# EAGLE design anglesenseor (EAGLE 9.2.2)
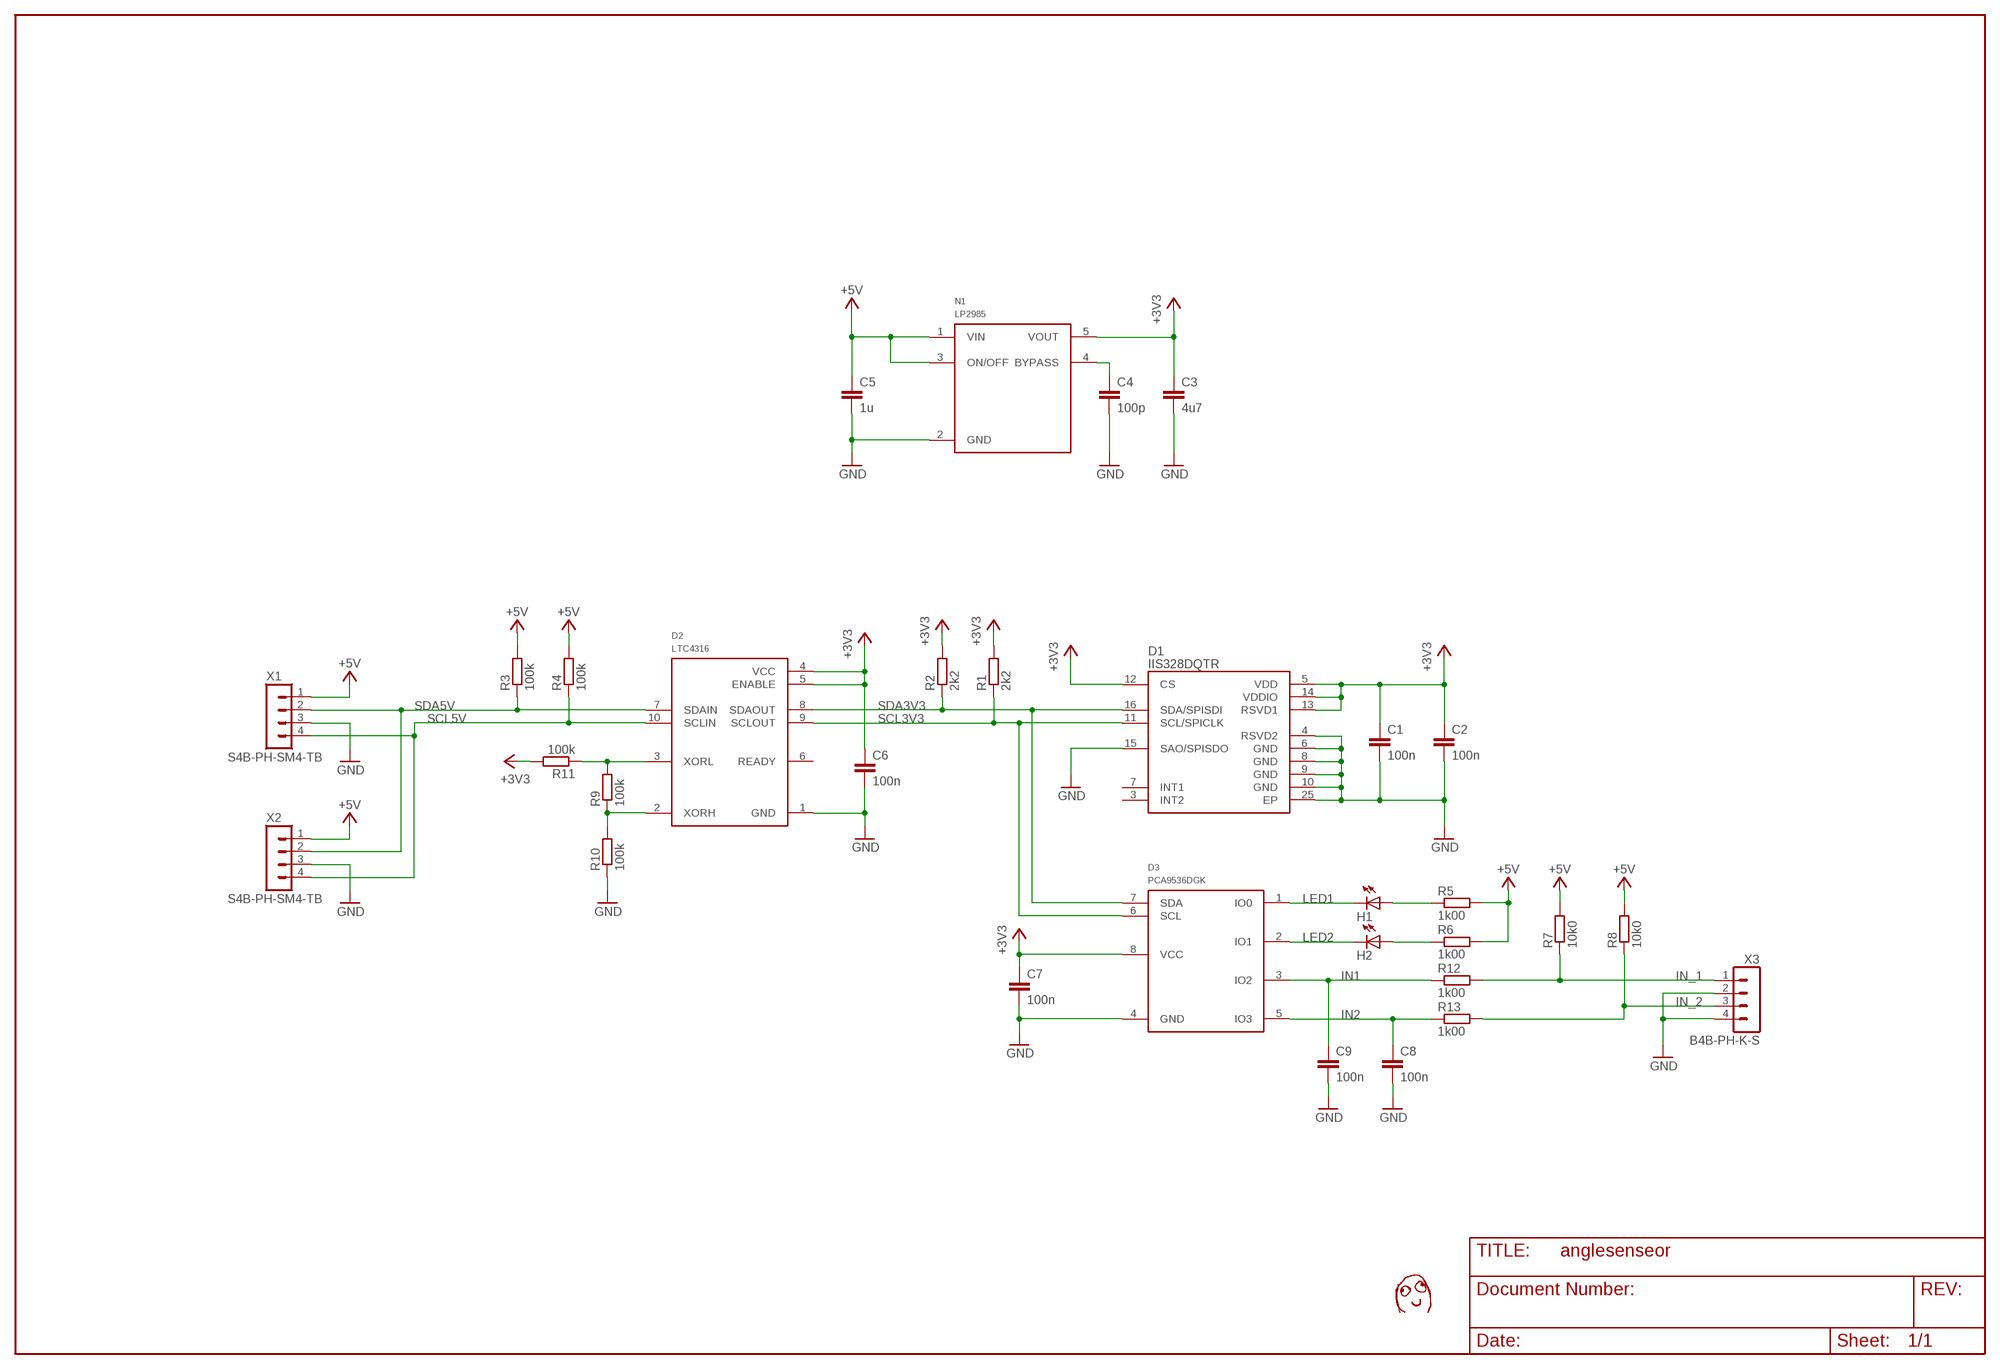
[diagram p0: schematic, sheet 1]

## Parts
C1  100n  CAP0603  [C0603]
C2  100n  CAP0603  [C0603]
C3  4u7  CAP0805  [OMAT_IC_2_C0805]
C4  100p  CAP0603  [OMAT_IC_2_C0603]
C5  1u  CAP0603  [OMAT_IC_2_C0603]
C6  100n  CAP0603  [C0603]
C7  100n  CAP0603  [C0603]
C8  100n  CAP0603  [C0603]
C9  100n  CAP0603  [C0603]
D1  IIS328DQTR  [QFN50P400X400X100-25N]
D2  LTC4316  [MSOP-10]
D3  PCA9536DGK  [TSSOP8-66]
H1  LEDCHIPLED_0603  [CHIPLED_0603]
H2  LEDCHIPLED_0603  [CHIPLED_0603]
N1  LP2985  [SOT95P280X145-5N]
R1  2k2  RES0603  [R0603]
R2  2k2  RES0603  [R0603]
R3  100k  RES0603  [R0603]
R4  100k  RES0603  [R0603]
R5  1k00  RES0603  [R0603]
R6  1k00  RES0603  [R0603]
R7  10k0  RES0603  [R0603]
R8  10k0  RES0603  [R0603]
R9  100k  RES0603  [R0603]
R10  100k  RES0603  [R0603]
R11  100k  RES0603  [R0603]
R12  1k00  RES0603  [R0603]
R13  1k00  RES0603  [R0603]
U$1  DAFUG  [DAFUG]
X1  S4B-PH-SM4-TB  [JST-PH2.0-RA-4]
X2  S4B-PH-SM4-TB  [JST-PH2.0-RA-4]
X3  B4B-PH-K-S  [B4B-PH-K-S]

## Nets
+3V3: C1.1 C2.1 C3.1 C6.1 C7.1 D1.5(VDD) D1.12(CS) D1.13(RSVD1) D1.14(VDDIO) D2.4(VCC) D2.5(ENABLE) D3.8(VCC) N1.5(VOUT) R1.2 R2.2 R11.2
+5V: C5.1 N1.1(VIN) N1.3(ON/OFF) R3.2 R4.2 R5.2 R6.2 R7.2 R8.2 X1.1 X2.1
GND: C1.2 C2.2 C3.2 C4.2 C5.2 C6.2 C7.2 C8.2 C9.2 D1.4(RSVD2) D1.6(GND) D1.8(GND) D1.9(GND) D1.10(GND) D1.15(SAO/SPISDO) D1.25(EP) D2.1(GND) D3.4(GND) N1.2(GND) R10.1 X1.3 X2.3 X3.2 X3.4
IN1: C9.1 D3.3(IO2) R12.1
IN2: C8.1 D3.5(IO3) R13.1
IN_1: R7.1 R12.2 X3.1
IN_2: R8.1 R13.2 X3.3
LED1: D3.1(IO0) H1.C
LED2: D3.2(IO1) H2.C
N$1: C4.1 N1.4(BYPASS)
N$4: D2.3(XORL) R9.2 R11.1
N$7: D2.2(XORH) R9.1 R10.2
N$8: H2.A R6.1
N$9: H1.A R5.1
SCL3V3: D1.11(SCL/SPICLK) D2.9(SCLOUT) D3.6(SCL) R1.1
SCL5V: D2.10(SCLIN) R4.1 X1.4 X2.4
SDA3V3: D1.16(SDA/SPISDI) D2.8(SDAOUT) D3.7(SDA) R2.1
SDA5V: D2.7(SDAIN) R3.1 X1.2 X2.2
Unconnected: D1.3(INT2) D1.7(INT1) D2.6(READY)

## Library data of the parts
C1 C2 C6-C9 = passiivit:CAP
C3-C5 = cpu:CAP
D1 = piirit:IIS328DQTR
D2 = piirit:LTC4316
D3 = piirit:PCA9536
H1 H2 = diskreetit:LED: LED OSRAM: - CHIPLED LG R971, LG N971, LY N971, LG Q971, LY Q971, LO R971, LY R971 LH N974, LH R974 LS Q976, LO Q976, LY Q976 LO Q996 - Hyper CHIPLED LW Q18S LB Q993, LB Q99A, LB R99A - SideLED LS A670, LO A670, LY A670, LG A670, LP A670 LB A673, LV A673, LT A673, LW A673 LH A674 LY A675 LS A676, LA A676, LO A676, LY A676, LW A676 LS A679, LY A679, LG A679 - Hyper Micro SIDELED® LS Y876, LA Y876, LO Y876, LY Y876 LT Y87S - SmartLED LW L88C, LW L88S LB L89C, LB L89S, LG L890 LS L89K, LO L89K, LY L89K LS L896, LA L896, LO L896, LY L896 - TOPLED LS T670, LO T670, LY T670, LG T670, LP T670 LSG T670, LSP T670, LSY T670, LOP T670, LYG T670 LG T671, LOG T671, LSG T671 LB T673, LV T673, LT T673, LW T673 LH T674 LS T676, LA T676, LO T676, LY T676, LB T676, LH T676, LSB T676, LW T676 LB T67C, LV T67C, LT T67C, LS T67K, LO T67K, LY T67K, LW E67C LS E67B, LA E67B, LO E67B, LY E67B, LB E67C, LV E67C, LT E67C LW T67C LS T679, LY T679, LG T679 LS T770, LO T770, LY T770, LG T770, LP T770 LB T773, LV T773, LT T773, LW T773 LH T774 LS E675, LA E675, LY E675, LS T675 LS T776, LA T776, LO T776, LY T776, LB T776 LHGB T686 LT T68C, LB T68C - Hyper Mini TOPLED® LB M676 - Mini TOPLED Santana® LG M470 LS M47K, LO M47K, LY M47K Source: http://www.osram.convergy.de LUXEON: - LUMILED® LXK2-PW12-R00, LXK2-PW12-S00, LXK2-PW14-U00, LXK2-PW14-V00 LXK2-PM12-R00, LXK2-PM12-S00, LXK2-PM14-U00 LXK2-PE12-Q00, LXK2-PE12-R00, LXK2-PE12-S00, LXK2-PE14-T00, LXK2-PE14-U00 LXK2-PB12-K00, LXK2-PB12-L00, LXK2-PB12-M00, LXK2-PB14-N00, LXK2-PB14-P00, LXK2-PB14-Q00 LXK2-PR12-L00, LXK2-PR12-M00, LXK2-PR14-Q00, LXK2-PR14-R00 LXK2-PD12-Q00, LXK2-PD12-R00, LXK2-PD12-S00 LXK2-PH12-R00, LXK2-PH12-S00 LXK2-PL12-P00, LXK2-PL12-Q00, LXK2-PL12-R00 Source: www.luxeon.com KINGBRIGHT: KA-3528ASYC Source: www.kingbright.com
N1 = piirit:LP2985
R1-R13 = passiivit:RES
U$1 = omat:DAFUG
X1 X2 = liittimet:S4B-PH-SM4-TB
X3 = liittimet:B4B-PH-K-S

## Board
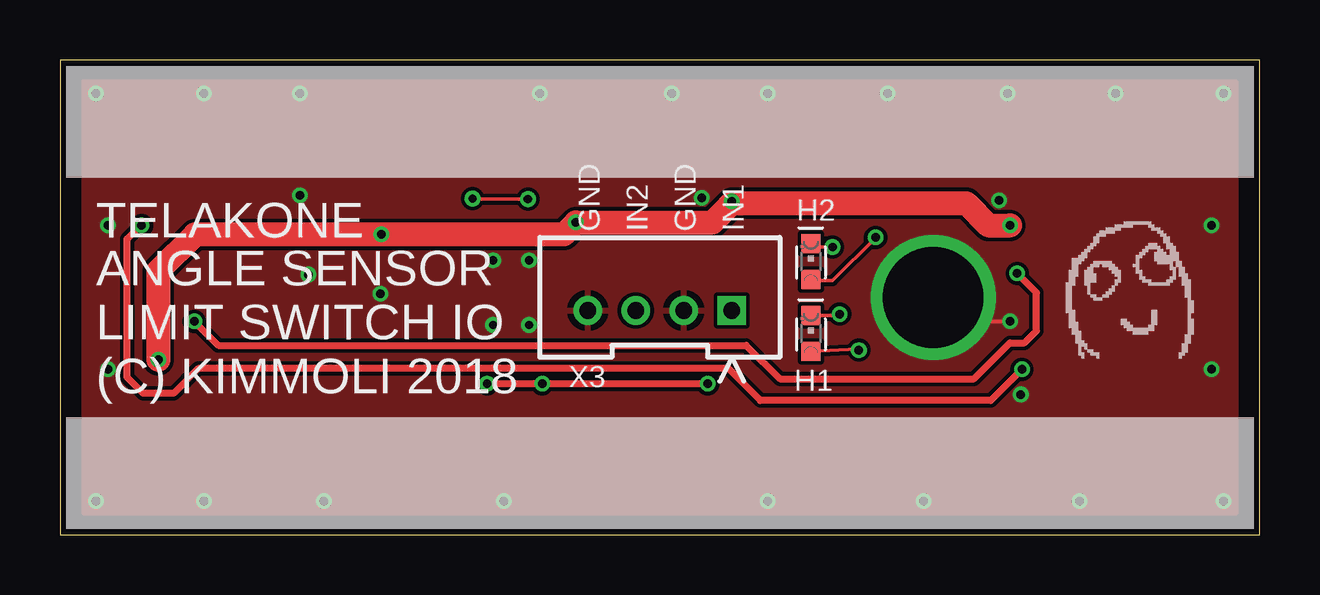
[diagram p1: board, top side]
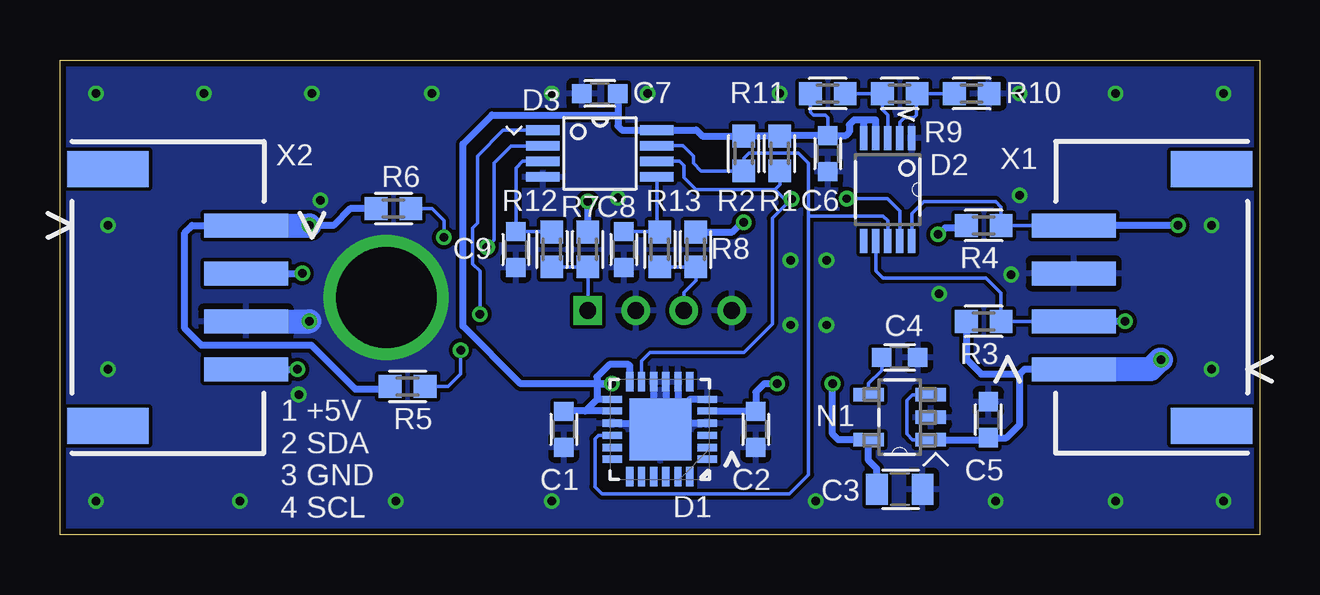
[diagram p2: board, bottom side, seen from below]

Size 50 x 19.8 mm. Coordinates in mm from the lower left corner, seen from the top.
Outline: 0,0 50,0 50,19.8 0,19.8 0,0
Copper layers (1*16): Top 0.035mm / dielectric 1.5mm / Bottom 0.035mm
Design rules "ITeadstudio": minimum track width 6mil, minimum drill 12mil, track to track 6mil, track to pad 6mil, pad to pad 6mil, via to via 6mil, smd to smd 0mil, copper to edge 10mil, drill to drill 10mil, minimum pad ring 10mil, minimum via ring 6mil, stop-mask expansion 2mil, vias tented up to drill 100mil, thermal gap 10mil
tKeepout: area 0,0 to 50,5.4; area 0,14.4 to 50,19.8

### Footprints (pad centres in the part's own frame; a part is rotated, then mirrored left to right if it is on the bottom)
C0603 = smd 0.8 x 0.8: 1 -0.75,0; 2 0.75,0
OMAT_IC_2_C0805 = smd 0.9 x 1.3: 1 -0.95,0; 2 0.95,0
OMAT_IC_2_C0603 = smd 0.8 x 0.8: 1 -0.75,0; 2 0.75,0
QFN50P400X400X100-25N = smd 0.813 x 0.305: 1 -1.981,1.245; 2 -1.981,0.762; 3 -1.981,0.254; 4 -1.981,-0.254; 5 -1.981,-0.762; 6 -1.981,-1.245; 13 1.981,-1.245; 14 1.981,-0.762; 15 1.981,-0.254; 16 1.981,0.254; 17 1.981,0.762; 18 1.981,1.245 | smd 0.305 x 0.813: 7 -1.245,-1.981; 8 -0.762,-1.981; 9 -0.254,-1.981; 10 0.254,-1.981; 11 0.762,-1.981; 12 1.245,-1.981; 19 1.245,1.981; 20 0.762,1.981; 21 0.254,1.981; 22 -0.254,1.981; 23 -0.762,1.981; 24 -1.245,1.981 | smd 2.591 x 2.591: 25 -0.025,0
MSOP-10 = smd 1 x 0.305: 1 -2.15,1; 2 -2.15,0.5; 3 -2.15,0; 4 -2.15,-0.5; 5 -2.15,-1; 6 2.15,-1; 7 2.15,-0.5; 8 2.15,0; 9 2.15,0.5; 10 2.15,1
TSSOP8-66 = smd 1.4 x 0.4: 1 -2.375,0.975; 2 -2.375,0.325; 3 -2.375,-0.325; 4 -2.375,-0.975; 5 2.375,-0.975; 6 2.375,-0.325; 7 2.375,0.325; 8 2.375,0.975
CHIPLED_0603 = smd 0.8 x 0.8: A 0,-0.75; C 0,0.75
SOT95P280X145-5N = smd 1.27 x 0.559: 1 -1.295,0.94; 2 -1.295,0; 3 -1.295,-0.94; 4 1.295,-0.94; 5 1.295,0.94
R0603 = smd 0.95 x 0.95: 1 -0.725,0; 2 0.725,0
JST-PH2.0-RA-4 = smd 1 x 3.5: 1 3,-7.25; 2 1,-7.25; 3 -1,-7.25; 4 -3,-7.25 | smd 1.5 x 3.4: M1 5.35,-1.5; M2 -5.35,-1.5
B4B-PH-K-S = drill 0.7 square: 1 -3,0.55 | drill 0.7: 2 -1,0.55; 3 1,0.55; 4 3,0.55

### Placement (x,y rotation side)
C1  29,4.4 270 bottom
C2  21,4.4 270 bottom
C3  15,1.9 0 bottom
C4  15,7.4 0 bottom
C5  11.3,4.8 90 bottom
C6  18,15.9 270 bottom
C7  27.5,18.4 180 bottom
C8  26.5,11.9 270 bottom
C9  31,11.9 270 bottom
D1  25,4.4 180 bottom
D2  15.5,14.4 270 bottom
D3  27.5,15.9 0 bottom
H1  31.3,8.4 0 top
H2  31.3,11.4 0 top
N1  15,4.9 180 bottom
R1  20,15.9 90 bottom
R2  21.5,15.9 90 bottom
R3  11.5,8.9 180 bottom
R4  11.5,12.9 180 bottom
R5  35.51,6.18 180 bottom
R6  36.1,13.6 180 bottom
R7  28,11.9 90 bottom
R8  23.5,11.9 90 bottom
R9  15,18.4 180 bottom
R10  12,18.4 180 bottom
R11  18,18.4 180 bottom
R12  29.5,11.9 270 bottom
R13  25,11.9 270 bottom
U$1  44.79,9.95 0 top
X1  0.5,9.9 270 bottom
X2  49.5,9.9 90 bottom
X3  25,9.9 180 top

### Tracks (layer width: path | path; a pad name or v marks a point on that pad's centre or on a via)
+3V3  (via drill 0.35)
  Top 0.3: v17.8,6.3 v20.1,6.3 v27,6.3
  Bottom 0.152: R11.2 18.73,17.62 18.6,17.5 18.1,17.5 18,17.4 C6.1
  Bottom 0.3: C3.1 15.95,2.75 16.3,3.1 N1.5 17.56,3.96 17.8,4.2 v17.8,6.3 | D1.5 21.01,5.16 C2.1 21,5.95 20.65,6.3 v20.1,6.3 | D1.14 28.1,5.16 | 28.1,5.16 28.99,5.16 C1.1 | D1.13 27.62,5.64 | 27.62,5.64 28.1,5.16 | D1.12 26.25,7.04 26.3,7.1 27.1,7.1 27.62,6.58 27.62,6.3 | C7.1 26.75,17.5 | 26.75,17.5 26.75,17.05 26.57,16.88 D3.8 23.48,16.88 23.23,16.62 R2.2 R1.2 19.98,16.65 C6.1 17.25,16.65 17.1,16.8 17.1,17.1 16.9,17.3 16.5,17.3 | 27.62,6.3 27.62,5.64 | 27.62,6.3 v27,6.3 30.8,6.3 33.2,8.7 33.2,16.3 32,17.5 26.75,17.5 | D2.4 16,17.3 16.5,17.3 | D2.5 16.5,17.3
+5V  (via drill 0.35)
  Top 0.3: v28,13.9 27.9,13.8 27.9,13.73
  Top 1: v4.1,7.3 4.1,11 5.63,12.53 v13.4,12.53 21,12.53 v21.5,13.03 27.2,13.03 27.9,13.73 28,13.83 37.77,13.83 38.7,12.9 v39.6,12.9
  Bottom 0.152: N1.1 14.46,3.96 14.7,4.2 14.7,5.6 14.46,5.84 N1.3
  Bottom 0.3: N1.1 11.39,3.96 C5.1 10.55,4.05 10,4.6 10,6.7 | 10,6.7 9.8,6.9 7.8,6.9 X1.1 | R8.2 21.98,12.62 21.5,13.1 v21.5,13.03 | R7.2 v28,13.9 | R3.2 12.22,7.33 11.6,6.7 10,6.7 | R4.2 12.32,12.8 13.1,12.8 13.4,12.5 v13.4,12.53 | R6.2 37.9,13.6 38.6,12.9 v39.6,12.9 | R5.2 36.34,6.08 37.7,6.08 39.52,7.9 44.1,7.9 44.8,8.6 44.8,12.6 44.5,12.9 X2.1
  Bottom 1: v4.1,7.3 4.15,7.3 4.55,6.9 7.8,6.9 | X2.1 v39.6,12.9
GND  (via drill 0.35, 4.2 pad 5.2)
  Top 0.152: v39.6,8.9 37.4,8.9 v36.4,9.9
  Bottom 0.3: D1.4 24.72,4.65 D1.25 | D1.6 23.73,5.64 24.24,5.14 | 24.24,5.14 24.54,4.84 | 24.54,4.84 D1.25 | D1.8 24.24,5.14 | D1.9 24.75,5.05 | 24.75,5.05 24.54,4.84 | D1.10 25.25,5.55 24.75,5.05 | D1.15 25.23,4.65 D1.25
  Bottom 1: 42.05,8.9 v39.6,8.9
  other vias: 48,6.9 48,12.9 2,12.9 2,6.9 10,14.15 26.75,14.05 10.35,10.85 13.35,10.05 18.05,11.45 19.55,8.75 19.55,11.45 18.05,8.75 39.15,13.95 40.05,5.85 1.5,18.4 6,18.4 10,18.4 20,18.4 25.5,18.4 29.5,18.4 34.5,18.4 39.5,18.4 48.5,18.4 44,18.4 48.5,1.4 42.5,1.4 36,1.4 29.5,1.4 18.5,1.4 11,1.4 1.5,1.4 6,1.4
  pour Bottom: 50,19.8 0,19.8 0,0 50,0
  pour Top: 49,0.9 1,0.9 1,18.9 49,18.9
IN1
  Bottom 0.152: R12.1 29.52,12.65 C9.1 31,15.3 30.73,15.57 D3.3
IN2
  Bottom 0.152: C8.1 25.02,12.65 R13.1 25.12,12.75 D3.5
IN_1
  Bottom 0.152: R12.2 R7.1 X3.1
IN_2
  Bottom 0.152: X3.3 24,10.1 23.5,10.6 R8.1 R13.2
LED1  (via drill 0.35)
  Top 0.152: H1.C 32.45,9.15 v32.5,9.2
  Bottom 0.152: D3.1 31.52,16.88 32.6,15.8 32.6,13 32.8,12.8 32.8,11.3 32.5,11 v32.5,9.2
LED2  (via drill 0.35)
  Top 0.152: H2.C 31.35,12 v32.2,12
  Bottom 0.152: D3.2 29.9,16.2 31.2,16.2 31.9,15.5 31.9,12.3 v32.2,12
N$1
  Bottom 0.152: C4.1 15.75,6.85 16.3,6.3 N1.4
N$4
  Bottom 0.152: D2.3 15.5,17.5 15.72,17.73 R9.2 R11.1
N$7
  Bottom 0.152: D2.2 15,17.2 14.8,17.4 14.4,17.4 14.3,17.5 14.3,18.38 R9.1 R10.2
N$8  (via drill 0.35)
  Top 0.152: H2.A 31.35,10.6 32.2,10.6 v34,12.4
  Bottom 0.152: R6.1 34.5,13.6 34,13.1 v34,12.4
N$9  (via drill 0.35)
  Top 0.152: H1.A 33.25,7.75 v33.3,7.7
  Bottom 0.152: R5.1 33.82,6.18 33.3,6.7 v33.3,7.7
SCL3V3  (via drill 0.35)
  Top 0.152: v17.2,14.02 17.22,14 v19.51,14
  Bottom 0.152: D3.6 24.18,15.57 24,15.4 24,14.9 23.5,14.4 20.2,14.4 | 20.2,14.4 20,14.6 R1.1 | D2.9 15,13.5 15.52,14.02 v17.2,14.02 | 20.2,14.4 19.8,14 v19.51,14 20.31,13.2 20.31,8.79 21.5,7.6 25.4,7.6 25.76,7.24 D1.11
SCL5V  (via drill 0.35)
  Top 0.3: v40.1,6.9 38.8,5.6 29.19,5.6 27.86,6.93 5.76,6.93 4.73,5.9 3.47,5.9 2.8,6.57 2.8,12.33 3.37,12.9 v3.4,12.9
  Bottom 0.152: X1.4 R4.1 10.78,13.68 11,13.9 14,13.9 14.5,13.4 D2.10
  Bottom 0.3: X2.4 v40.1,6.9 | v3.4,12.9 X1.4
SDA3V3
  Bottom 0.152: D3.7 24.02,16.23 23.6,15.8 23.6,15.5 23.27,15.18 R2.1 21.5,15.7 21.28,15.92 19.22,15.92 18.8,15.5 18.8,13.3 | 18.8,13.3 15.7,13.3 15.5,13.1 D2.8 | D1.16 27.55,4.15 27.7,4 27.7,2 27.4,1.7 19.6,1.7 18.8,2.5 18.8,13.3
SDA5V  (via drill 0.35)
  Top 0.3: v5.6,8.9 6.6,7.9 28.6,7.9 30,6.5 38.1,6.5 39.6,8 40.2,8 40.7,8.5 40.7,10.1 v39.9,10.9
  Bottom 0.152: X1.2 R3.1 10.78,10.07 11.4,10.7 15.7,10.7 16,11 D2.7
  Bottom 0.3: X2.2 v39.9,10.9 | v5.6,8.9 X1.2

### Text on the board
tPlace: GND | IN2 | GND | IN1 | TELAKONE | ANGLE SENSOR / LIMIT SWITCH IO | (C) KIMMOLI 2018
bPlace: 1 +5V / 2 SDA / 3 GND / 4 SCL